# EAGLE design ink2 (EAGLE 8.0.2)
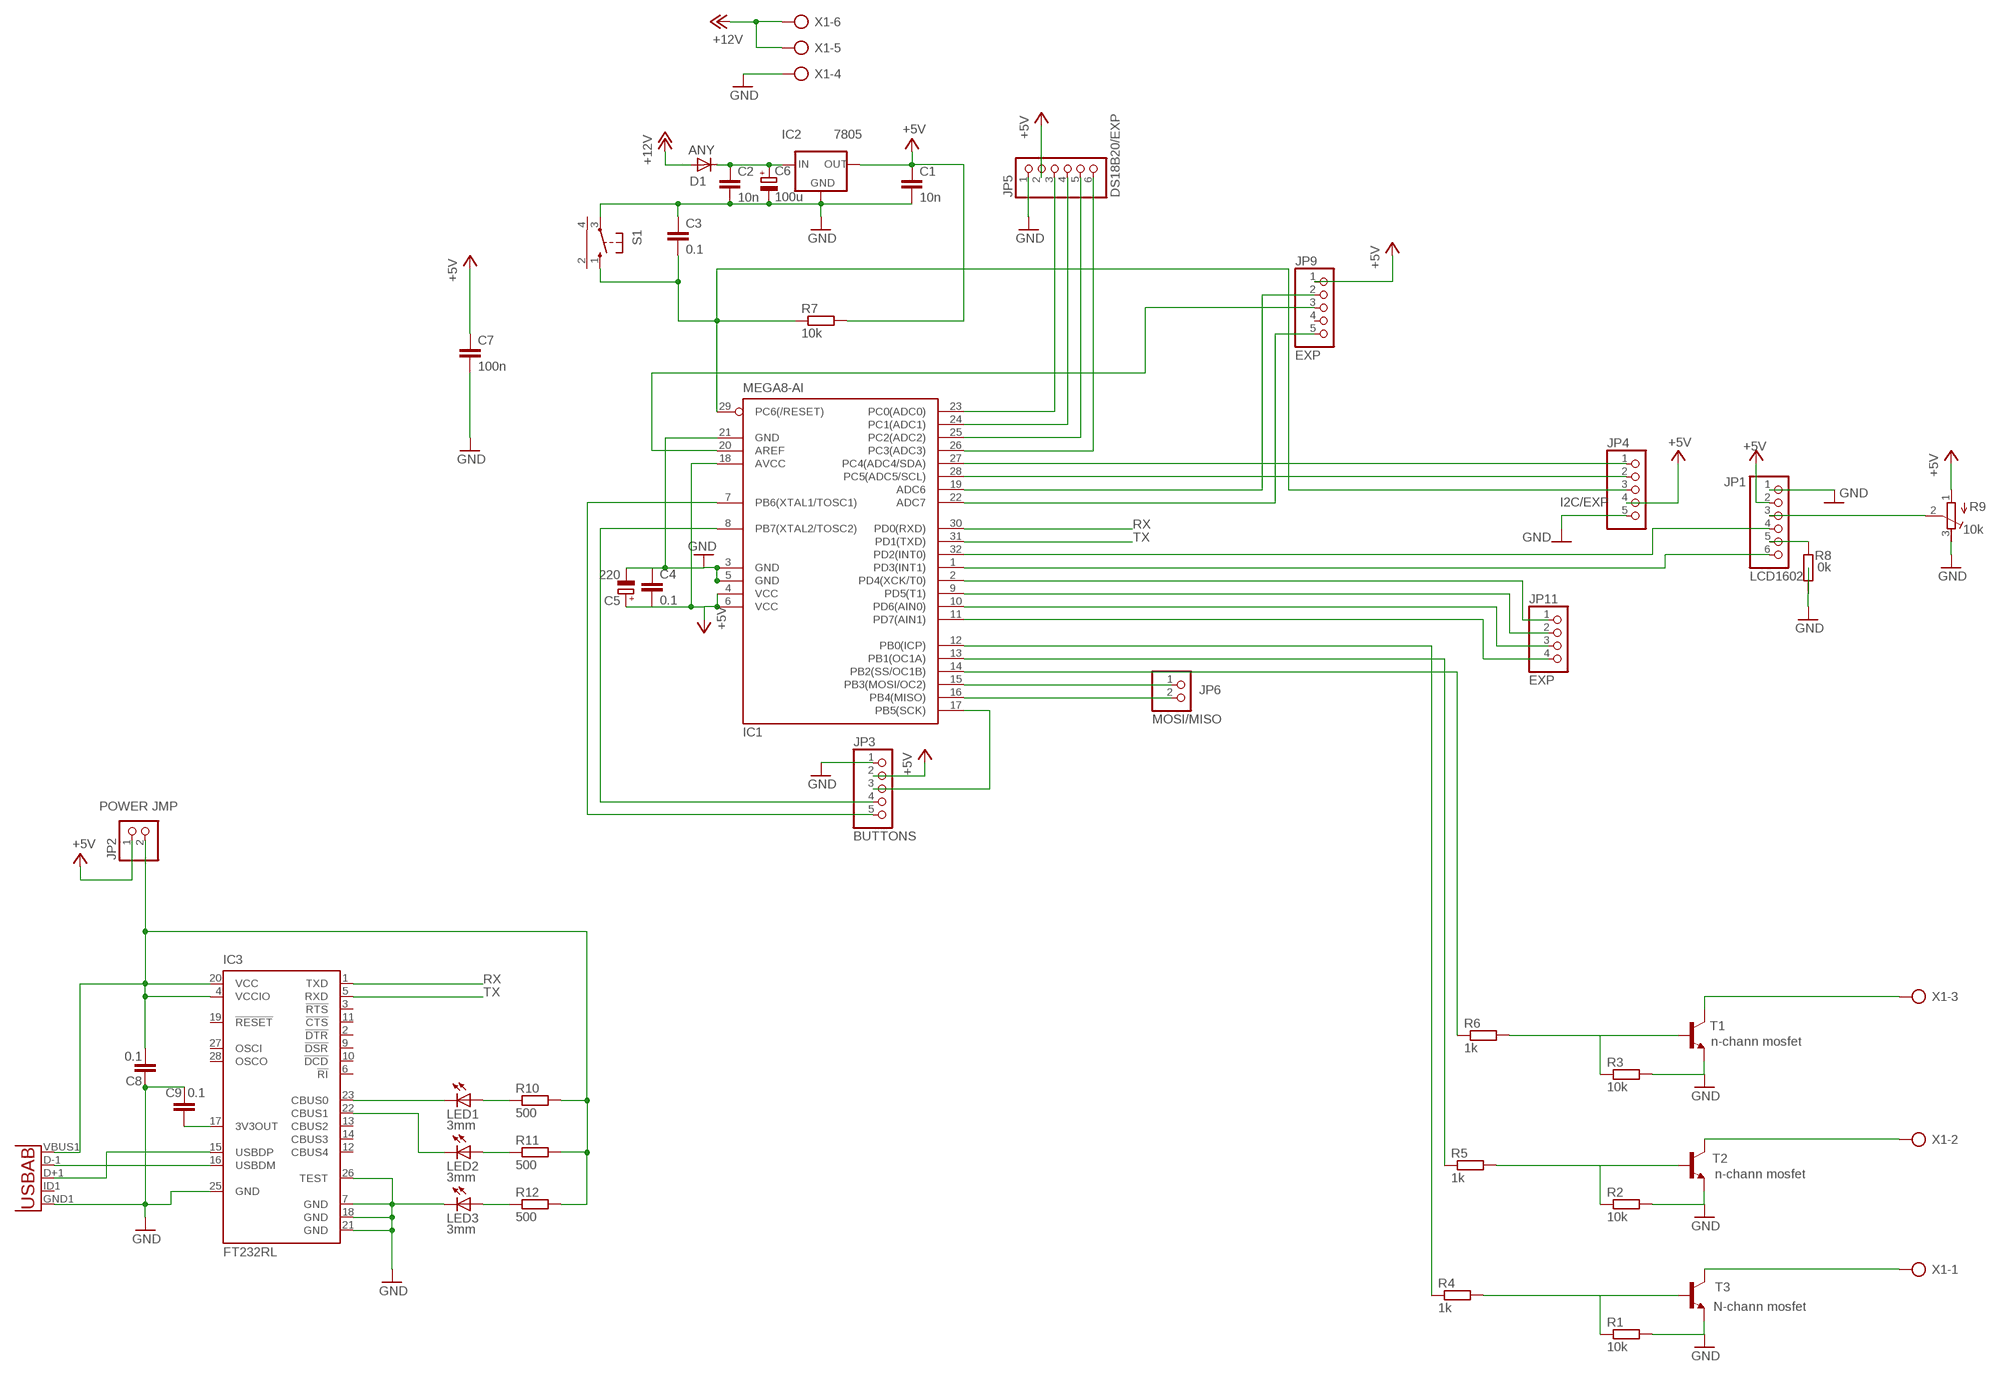
[diagram p0: schematic, sheet 1]

## Parts
ANY  D1  CGRM4001-G  [SOD-123_MINI-SMA]
C1  10n  C-EUC1206  [C1206]
C2  10n  C-EUC1206  [C1206]
C3  0.1  C-EUC1206  [C1206]
C4  0.1  C-EUC1206  [C1206]
C5  220  CPOL-EU175TMP-0808  [175TMP-0808]
C6  100u  CPOL-EU140CLH-1010  [140CLH-1010]
C7  100n  C-EUC1206K  [C1206K]
C8  0.1  C-EUC1206  [C1206]
C9  0.1  C-EUC1206  [C1206]
IC1  MEGA8-AI  [TQFP32-08]
IC2  7805  78MXXLDP  [DPACK]
IC3  FT232RL  [SSOP28]
JP1  LCD1602  PINHD-1X6  [1X06]
JP2  POWER JMP  PINHD-1X2  [1X02]
JP3  BUTTONS  PINHD-1X5  [1X05]
JP4  I2C/EXP  PINHD-1X5  [1X05]
JP5  DS18B20/EXP  PINHD-1X6  [1X06]
JP6  MOSI/MISO  PINHD-1X2  [1X02]
JP9  EXP  PINHD-1X5  [1X05]
JP11  EXP  PINHD-1X4  [1X04]
LED1  3mm  LED3MM  [LED3MM]
LED2  3mm  LED3MM  [LED3MM]
LED3  3mm  LED3MM  [LED3MM]
R1  10k  R-EU_M1206  [M1206]
R2  10k  R-EU_M1206  [M1206]
R3  10k  R-EU_M1206  [M1206]
R4  1k  R-EU_M1206  [M1206]
R5  1k  R-EU_M1206  [M1206]
R6  1k  R-EU_M1206  [M1206]
R7  10k  R-EU_M1206  [M1206]
R8  0k  R-EU_M1206  [M1206]
R9  10k  R-TRIMM64Y  [RTRIM64Y]
R10  500  R-EU_M1206  [M1206]
R11  500  R-EU_M1206  [M1206]
R12  500  R-EU_M1206  [M1206]
S1  10-XX-RPAD  [B3F-10XX-RPAD]
T1  n-chann mosfet  MJD31  [DPAK]
T2  n-chann mosfet  MJD31  [DPAK]
T3  N-chann mosfet  MJD31  [DPAK]
U1  USB""  [USB-MICRO-SMD]
X1  AK300/6  [AK300/6]

## Nets
+5V: C1.1 C4.2 C5.+ C7.1 IC1.4(VCC) IC1.6(VCC) IC1.18(AVCC) IC2.3(OUT) JP1.2 JP2.1 JP3.2 JP4.4 JP5.2 JP9.1 R7.2 R9.1(A)
+12V: ANY.A X1.5 X1.6
GND: C1.2 C2.2 C3.1 C4.1 C5.- C6.- C7.2 C8.2 C9.2 IC1.3(GND) IC1.5(GND) IC1.21(GND) IC2.4(GND) IC3.7(GND) IC3.18(GND) IC3.21(GND) IC3.25(GND) IC3.26(TEST) JP1.1 JP3.1 JP4.5 JP5.1 LED3.K(C) R1.2 R2.2 R3.2 R8.2 R9.3(E) S1.3(P) T1.3(E) T2.3(E) T3.3(E) U1.GND1(GND) X1.4
N$1: IC1.11(PD7(AIN1)) JP11.4
N$2: IC1.1(PD3(INT1)) JP1.6
N$3: IC1.2(PD4(XCK/T0)) JP11.1
N$4: ANY.C C2.1 C6.+ IC2.1(IN)
N$5: IC1.15(PB3(MOSI/OC2)) JP6.1
N$6: JP1.3 R9.2(S)
N$7: IC1.17(PB5(SCK)) JP3.3
N$8: IC1.16(PB4(MISO)) JP6.2
N$10: IC1.8(PB7(XTAL2/TOSC2)) JP3.4
N$11: IC1.7(PB6(XTAL1/TOSC1)) JP3.5
N$12: R1.1 R4.2 T3.1(B)
N$13: R2.1 R5.2 T2.1(B)
N$14: R3.1 R6.2 T1.1(B)
N$15: IC1.10(PD6(AIN0)) JP11.3
N$16: IC1.9(PD5(T1)) JP11.2
N$17: IC1.14(PB2(SS/OC1B)) R6.1
N$18: IC1.27(PC4(ADC4/SDA)) JP4.1
N$19: IC1.28(PC5(ADC5/SCL)) JP4.2
N$20: IC1.23(PC0(ADC0)) JP5.3
N$21: T1.4(C) X1.3
N$22: T2.4(C) X1.2
N$23: T3.4(C) X1.1
N$24: IC1.24(PC1(ADC1)) JP5.4
N$25: IC1.25(PC2(ADC2)) JP5.5
N$26: IC1.26(PC3(ADC3)) JP5.6
N$29: IC1.32(PD2(INT0)) JP1.4
N$30: IC3.23(CBUS0) LED1.K(C)
N$31: IC3.16(USBDM) U1.D-1(D-)
N$32: IC1.20(AREF) JP9.3
N$33: IC1.19(ADC6) JP9.2
N$34: IC1.22(ADC7) JP9.5
N$36: IC3.22(CBUS1) LED2.K(C)
N$38: LED2.A R11.1
N$39: IC1.13(PB1(OC1A)) R5.1
N$40: IC1.12(PB0(ICP)) R4.1
N$41: JP1.5 R8.1
N$42: IC3.15(USBDP) U1.D+1(D+)
N$43: LED1.A R10.1
N$44: C9.1 IC3.17(3V3OUT)
N$45: C8.1 IC3.4(VCCIO) IC3.20(VCC) JP2.2 R10.2 R11.2 R12.2 U1.VBUS1(VBUS)
N$46: LED3.A R12.1
RESET: C3.2 IC1.29(PC6(/RESET)) JP4.3 R7.1 S1.1(S)
RX: IC1.30(PD0(RXD)) IC3.1(TXD)
TX: IC1.31(PD1(TXD)) IC3.5(RXD)
Unconnected: IC3.2(!DTR) IC3.3(!RTS) IC3.6(!RI) IC3.9(!DSR) IC3.10(!DCD) IC3.11(!CTS) IC3.12(CBUS4) IC3.13(CBUS2) IC3.14(CBUS3) IC3.19(!RESET) IC3.27(OSCI) IC3.28(OSCO) JP9.4 S1.2(GND1) S1.4(GND2) U1.ID1(USBID)

## Library data of the parts
ANY = diode:CGRM400*-G: Molded plasitc,JEDEC SOD-123/Mini SMA Source: Comchip CGRM4001-G.pdf
C1-C4 C7-C9 = resistor:C-EU: CAPACITOR, European symbol
C5 C6 = resistor:CPOL-EU: POLARIZED CAPACITOR, European symbol
IC1 = atmel:MEGA8: MICROCONTROLLER 8 Kbytes FLASH, 1 kbytes SRAM, 512 bytes EEPROM, USART, 6-channel 10 bit ADC, 2-channel 8 bit ADC Pin compatible with Atmega48, ATMega88, ATMega168 Source: avr.lbr; MPN: ATMEGA8-16AU; OC_FARNELL: 9171371; OC_NEWARK: 73M8863
IC2 = v-reg:78MXXL: VOLTAGE REGULATOR
IC3 = ftdichip:FT232R: Source: http://www.ftdichip.com/Documents/DataSheets/DS_FT232R_v104.pdf; MPN: FT232RL; OC_FARNELL: 1146032; OC_NEWARK: 91K9918
JP1 JP5 = pinhead:PINHD-1X6: PIN HEADER
JP2 JP6 = pinhead:PINHD-1X2: PIN HEADER
JP3 JP4 JP9 = pinhead:PINHD-1X5: PIN HEADER
JP11 = pinhead:PINHD-1X4: PIN HEADER
LED1-LED3 = led:LED: LED OSRAM: - CHIPLED LG R971, LG N971, LY N971, LG Q971, LY Q971, LO R971, LY R971 LH N974, LH R974 LS Q976, LO Q976, LY Q976 LO Q996 - Hyper CHIPLED LW Q18S LB Q993, LB Q99A, LB R99A - SideLED LS A670, LO A670, LY A670, LG A670, LP A670 LB A673, LV A673, LT A673, LW A673 LH A674 LY A675 LS A676, LA A676, LO A676, LY A676, LW A676 LS A679, LY A679, LG A679 - Hyper Micro SIDELED® LS Y876, LA Y876, LO Y876, LY Y876 LT Y87S - SmartLED LW L88C, LW L88S LB L89C, LB L89S, LG L890 LS L89K, LO L89K, LY L89K LS L896, LA L896, LO L896, LY L896 - TOPLED LS T670, LO T670, LY T670, LG T670, LP T670 LSG T670, LSP T670, LSY T670, LOP T670, LYG T670 LG T671, LOG T671, LSG T671 LB T673, LV T673, LT T673, LW T673 LH T674 LS T676, LA T676, LO T676, LY T676, LB T676, LH T676, LSB T676, LW T676 LB T67C, LV T67C, LT T67C, LS T67K, LO T67K, LY T67K, LW E67C LS E67B, LA E67B, LO E67B, LY E67B, LB E67C, LV E67C, LT E67C LW T67C LS T679, LY T679, LG T679 LS T770, LO T770, LY T770, LG T770, LP T770 LB T773, LV T773, LT T773, LW T773 LH T774 LS E675, LA E675, LY E675, LS T675 LS T776, LA T776, LO T776, LY T776, LB T776 LHGB T686 LT T68C, LB T68C - Hyper Mini TOPLED® LB M676 - Mini TOPLED Santana® LG M470 LS M47K, LO M47K, LY M47K Source: http://www.osram.convergy.de LUXEON: - LUMILED® LXK2-PW12-R00, LXK2-PW12-S00, LXK2-PW14-U00, LXK2-PW14-V00 LXK2-PM12-R00, LXK2-PM12-S00, LXK2-PM14-U00 LXK2-PE12-Q00, LXK2-PE12-R00, LXK2-PE12-S00, LXK2-PE14-T00, LXK2-PE14-U00 LXK2-PB12-K00, LXK2-PB12-L00, LXK2-PB12-M00, LXK2-PB14-N00, LXK2-PB14-P00, LXK2-PB14-Q00 LXK2-PR12-L00, LXK2-PR12-M00, LXK2-PR14-Q00, LXK2-PR14-R00 LXK2-PD12-Q00, LXK2-PD12-R00, LXK2-PD12-S00 LXK2-PH12-R00, LXK2-PH12-S00 LXK2-PL12-P00, LXK2-PL12-Q00, LXK2-PL12-R00 Source: www.luxeon.com KINGBRIGHT: KA-3528ASYC Source: www.kingbright.com
R1-R7 R10-R12 = resistor:R-EU_: RESISTOR, European symbol
R8 = rcl:R-EU_: RESISTOR, European symbol
R9 = resistor:R-TRIMM: Trimm resistor
S1 = RepRapjr:10-XX-RPAD: OMRON SWITCH
T1-T3 = transistor-neu-to92:MJD31*: Complementary Power Transistors
U1 = microusb:USB: This is a USB AB connector that is compatible with USB OTG. i.e. this connector can serve as a host or device
X1 = con-ptr500:AK300/6: CONNECTOR; OC_FARNELL: unknown; OC_NEWARK: unknown

## Board
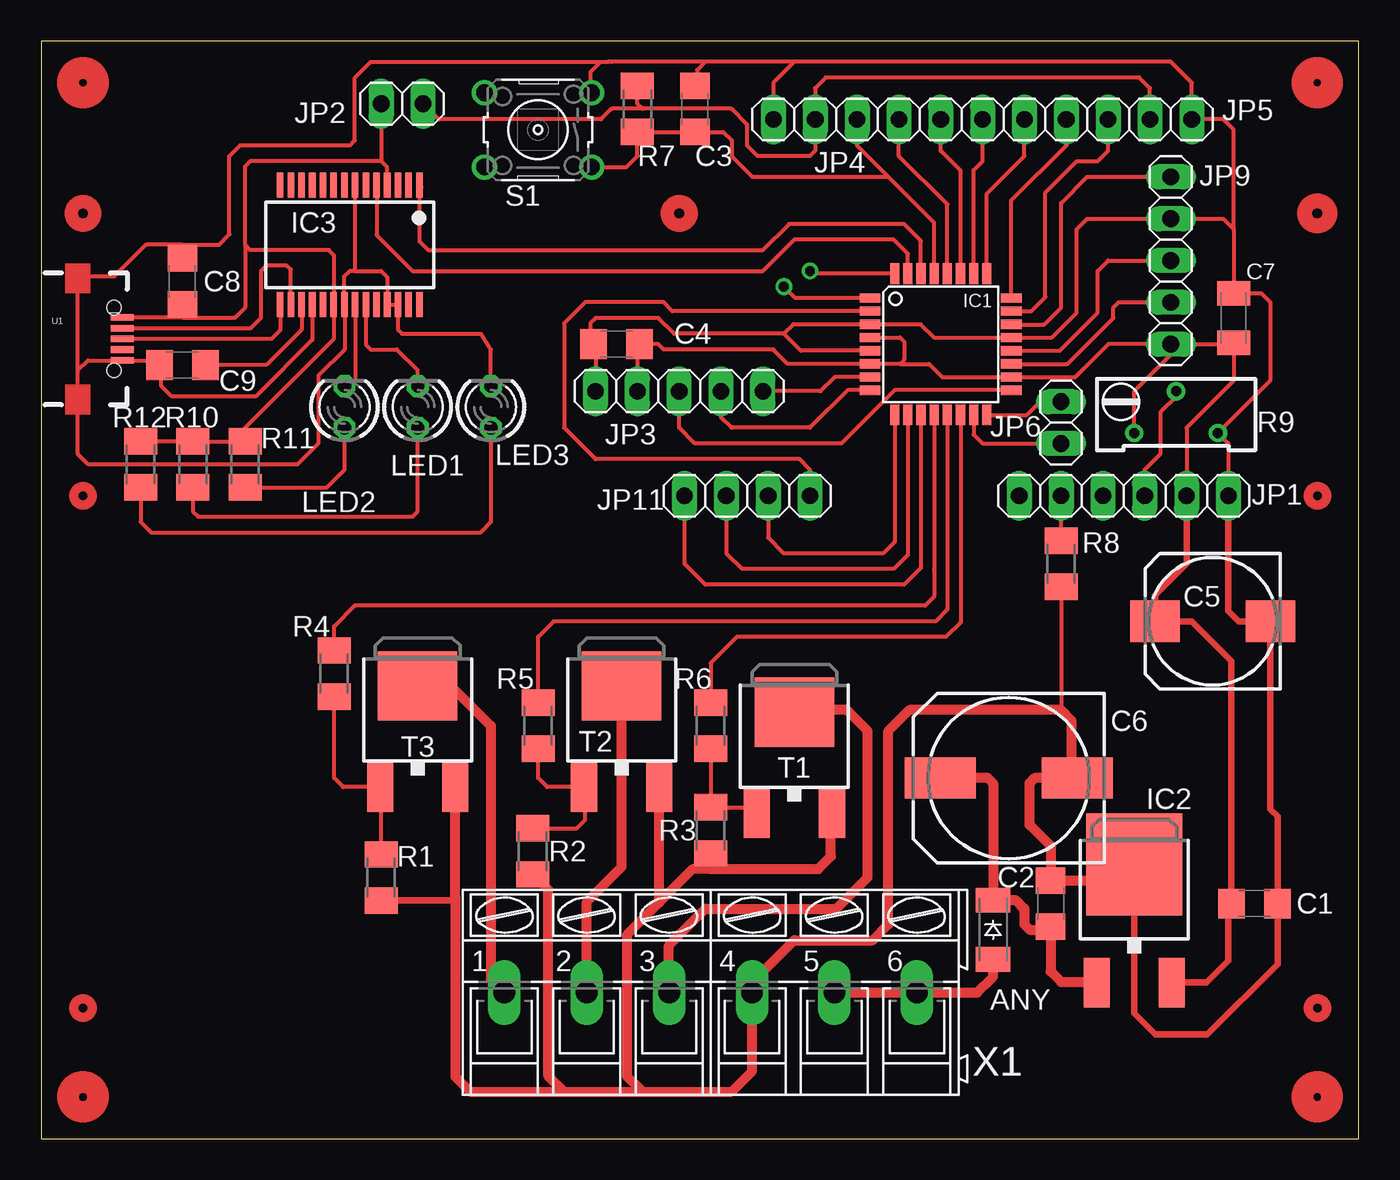
[diagram p1: board, top side]
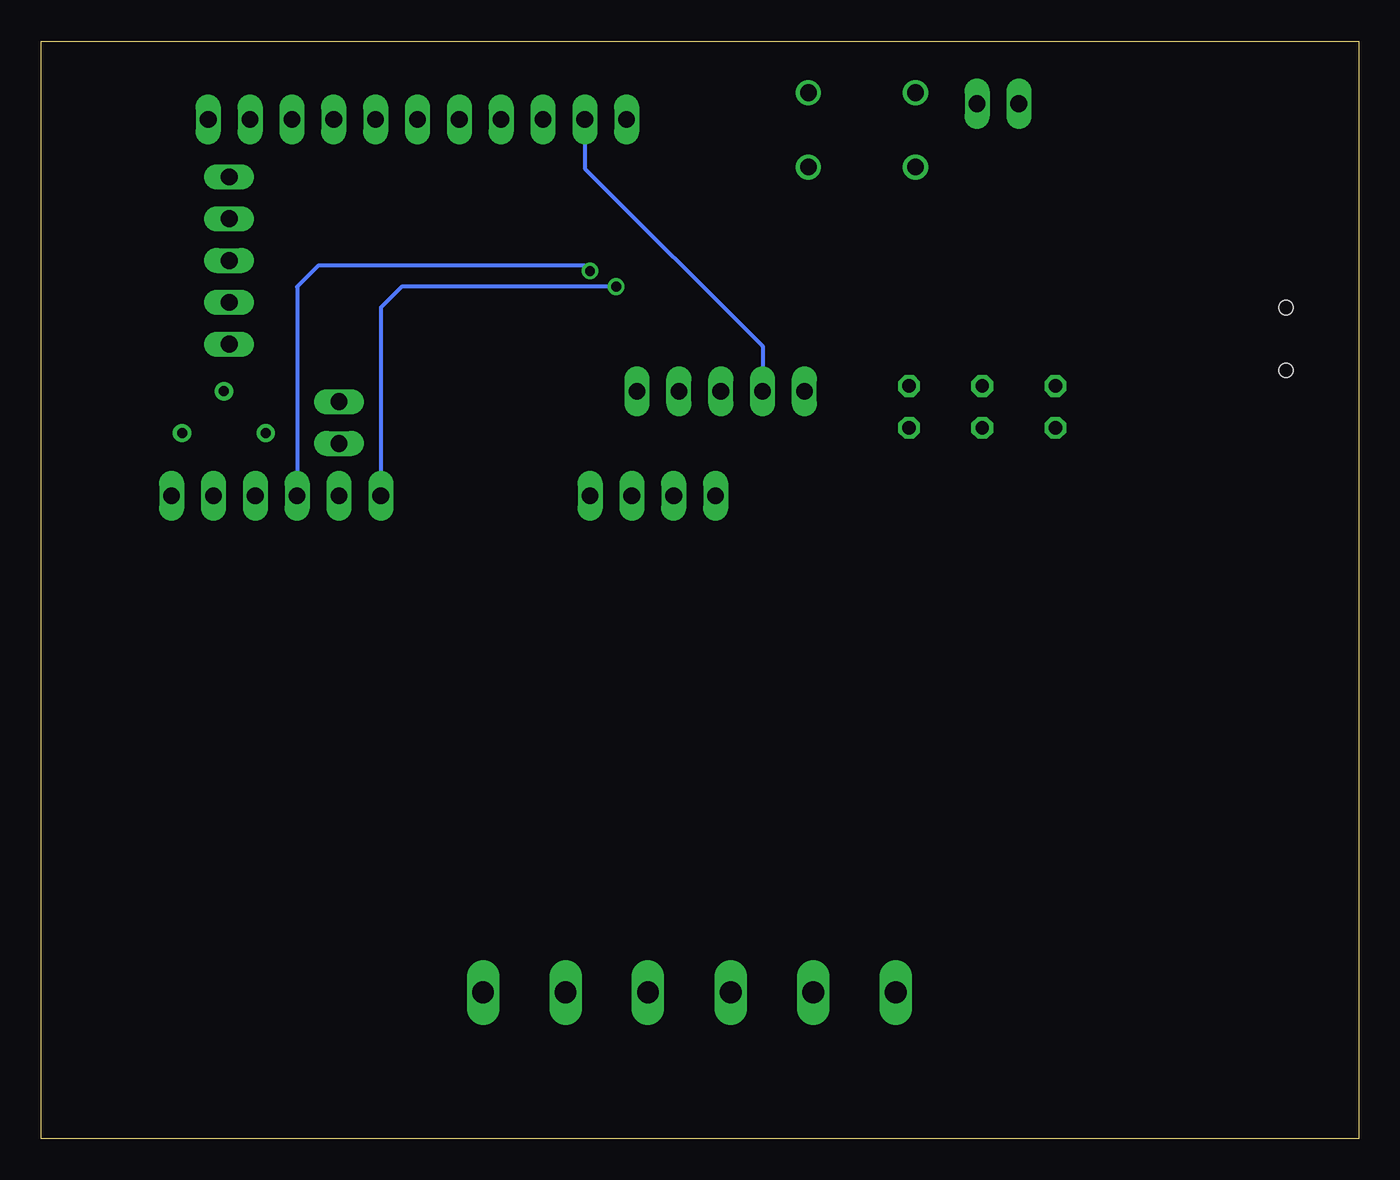
[diagram p2: board, bottom side, seen from below]

Size 79.99 x 66.66 mm. Coordinates in mm from the lower left corner, seen from the top.
Outline: 0,0 79.99,0 79.99,66.66 0,66.66 0,0
Copper layers (1*16): Top 0.035mm / dielectric 1.5mm / Bottom 0.035mm
Design rules "5class *": minimum track width 4mil, minimum drill 12mil, track to track 8mil, track to pad 8mil, pad to pad 8mil, via to via 8mil, smd to smd 8mil, copper to edge 40mil, drill to drill 8mil, minimum pad ring 10mil, minimum via ring 8mil, stop-mask expansion 4mil, vias tented up to drill 0mil, thermal gap 10mil

### Footprints (pad centres in the part's own frame; a part is rotated, then mirrored left to right if it is on the bottom)
SOD-123_MINI-SMA = smd 1.5 x 2.1: A 1.8,0; C -1.8,0
C1206 = smd 1.6 x 1.8: 1 -1.4,0; 2 1.4,0
175TMP-0808 = smd 3 x 2.5: + 3.5,0; - -3.5,0
140CLH-1010 = smd 4.3 x 2.5: + 4.15,0; - -4.15,0
C1206K = smd 1.5 x 2: 1 -1.5,0; 2 1.5,0
TQFP32-08 = smd 1.27 x 0.559: 1 -4.293,2.8; 2 -4.293,2; 3 -4.293,1.2; 4 -4.293,0.4; 5 -4.293,-0.4; 6 -4.293,-1.2; 7 -4.293,-2; 8 -4.293,-2.8; 17 4.293,-2.8; 18 4.293,-2; 19 4.293,-1.2; 20 4.293,-0.4; 21 4.293,0.4; 22 4.293,1.2; 23 4.293,2; 24 4.293,2.8 | smd 0.559 x 1.27: 9 -2.8,-4.293; 10 -2,-4.293; 11 -1.2,-4.293; 12 -0.4,-4.293; 13 0.4,-4.293; 14 1.2,-4.293; 15 2,-4.293; 16 2.8,-4.293; 25 2.8,4.293; 26 2,4.293; 27 1.2,4.293; 28 0.4,4.293; 29 -0.4,4.293; 30 -1.2,4.293; 31 -2,4.293; 32 -2.8,4.293
DPACK = smd 1.6 x 3: 1 -2.28,-4.8; 3 2.28,-4.8 | smd 5.8 x 6.2: 4 0,2.38
SSOP28 = smd 0.4 x 1.5: 1 -4.225,-3.625; 2 -3.575,-3.625; 3 -2.925,-3.625; 4 -2.275,-3.625; 5 -1.625,-3.625; 6 -0.975,-3.625; 7 -0.325,-3.625; 8 0.325,-3.625; 9 0.975,-3.625; 10 1.625,-3.625; 11 2.275,-3.625; 12 2.925,-3.625; 13 3.575,-3.625; 14 4.225,-3.625; 15 4.225,3.625; 16 3.575,3.625; 17 2.925,3.625; 18 2.275,3.625; 19 1.625,3.625; 20 0.975,3.625; 21 0.325,3.625; 22 -0.325,3.625; 23 -0.975,3.625; 24 -1.625,3.625; 25 -2.275,3.625; 26 -2.925,3.625; 27 -3.575,3.625; 28 -4.225,3.625
1X06 = drill 1.016 long: 1 -6.35,0; 2 -3.81,0; 3 -1.27,0; 4 1.27,0; 5 3.81,0; 6 6.35,0
1X02 = drill 1.016 long: 1 -1.27,0; 2 1.27,0
1X05 = drill 1.016 long: 1 -5.08,0; 2 -2.54,0; 3 0,0; 4 2.54,0; 5 5.08,0
1X04 = drill 1.016 long: 1 -3.81,0; 2 -1.27,0; 3 1.27,0; 4 3.81,0
LED3MM = drill 0.813 octagon: A -1.27,0; K 1.27,0
M1206 = smd 1.6 x 2: 1 -1.4,0; 2 1.4,0
RTRIM64Y = drill 0.61: 1 0,-2.54; 2 -2.54,0; 3 0,2.54
B3F-10XX-RPAD = drill 1.016: 1 -3.251,2.261; 2 3.251,2.261; 3 -3.251,-2.261; 4 3.251,-2.261
DPAK = smd 1.6 x 3: 1 -2.28,-4.04; 3 2.28,-4.04 | smd 4.826 x 4.191: 4 0,2.096
USB-MICRO-SMD = smd 1.4 x 0.4: D+1 2.7,0; D-1 2.7,0.65; GND1 2.7,-1.3; ID1 2.7,-0.65; VBUS1 2.7,1.3 | hole 0.85: 2.2,1.9; 2.2,-1.9
AK300/6 = drill 1.321 long: 1 -12.522,0; 2 -7.518,0; 3 -2.515,0; 4 2.515,0; 5 7.518,0; 6 12.522,0

### Placement (x,y rotation side)
ANY  57.78,12.7 270 top
C1  73.66,14.29 0 top
C2  61.28,14.29 90 top
C3  39.69,62.55 270 top
C4  34.92,48.26 0 top
C5  71.12,31.43 180 top
C6  58.74,21.91 180 top
C7  72.39,49.85 90 top
C8  8.57,52.07 90 top
C9  8.57,46.99 180 top
IC1  54.61,48.26 0 top
IC2  66.36,14.29 0 top
IC3  18.73,54.29 180 top
JP1  65.72,39.05 180 top
JP2  21.91,62.87 180 top
JP3  38.73,45.4 0 top
JP4  49.53,61.91 180 top
JP5  63.5,61.91 180 top
JP6  61.91,43.5 90 top
JP9  68.58,53.34 90 top
JP11  42.86,39.05 180 top
LED1  22.86,44.45 90 top
LED2  18.41,44.45 90 top
LED3  27.3,44.45 90 top
R1  20.64,15.88 270 top
R2  29.84,17.46 270 top
R3  40.64,18.73 270 top
R4  17.78,28.26 270 top
R5  30.16,25.08 270 top
R6  40.64,25.08 270 top
R7  36.19,62.55 90 top
R8  61.91,34.93 270 top
R9  68.9,42.86 270 top
R10  9.21,40.96 90 top
R11  12.38,40.96 90 top
R12  6.03,40.96 90 top
S1  30.16,61.28 180 top
T1  45.72,23.81 0 top
T2  35.24,25.4 0 top
T3  22.86,25.4 0 top
U1  2.22,48.58 0 top
X1  40.64,8.89 0 top

### Tracks (layer width: path | path; a pad name or v marks a point on that pad's centre or on a via)
+5V  (via drill 0.6)
  Top 0.254: 52.14,47.06 IC1.6 45.33,47.06 44.45,47.94 37.78,47.94 37.47,48.26 C4.2 36.19,48.13 JP3.2 | 52.14,47.06 52.39,47.31 52.39,48.42 52.15,48.66 IC1.4 | JP1.2 69.53,43.18 72.39,46.04 C7.1 72.3,48.26 JP9.1 | JP9.1 64.77,48.26 62.77,46.26 IC1.18 54.7,46.26 53.91,47.06 52.14,47.06 | JP9.1 68.58,47.62 66.36,45.4 R9.1 | JP5.2 67.31,63.82 66.67,64.45 47.62,64.45 46.99,63.82 JP4.4 46.99,60.01 46.67,59.69 43.5,59.69 42.86,60.33 42.86,61.6 41.91,62.55 36.51,62.55 | 36.51,62.55 36.19,62.87 R7.2 | JP2.1 24.13,61.91 33.97,61.91 34.61,62.55 36.51,62.55
  Top 0.305: 58.81,46.36 IC1.18 59,46.36
  Top 0.406: IC2.3 70.77,9.49 72.07,10.79 72.07,14.1 C1.1 | 72.07,14.47 C1.1 | JP1.2 69.53,34.93 67.63,33.02 C5.+ 69.85,31.43 72.26,29.02 C1.1
  Bottom 0.254: JP4.4 46.99,58.93 36.19,48.13 JP3.2
  other vias: 46.99,61.91
+12V
  Top 0.61: X1.5 X1.6 56.83,8.89 57.78,9.84 ANY.A
GND
  Top 0.254: 43.18,8.91 X1.4 | 25.01,14.47 25.14,14.61 | 72.39,55.25 71.75,55.88 63.5,55.88 62.86,55.25 62.86,50.17 61.36,48.66 IC1.21 54.21,48.66 53.41,49.46 IC1.3 45.65,49.46 45.08,48.9 | JP1.1 72.07,42.23 R9.3 74.61,46.04 74.61,50.8 74.06,51.35 C7.2 72.39,55.25 | R8.2 61.91,26.04 | 72.39,55.25 72.39,61.28 71.75,61.91 JP5.1 69.85,64.14 68.58,65.41 45.72,65.41 | 45.72,65.41 44.45,64.14 JP4.5 | 45.72,65.41 40.32,65.41 | 40.32,65.41 39.82,64.9 39.82,63.82 C3.1 | JP3.1 33.66,48.13 C4.1 33.34,48.45 33.34,49.53 33.66,49.85 37.47,49.85 38.42,48.9 45.08,48.9 | IC1.5 46.12,47.86 45.08,48.9 | 40.32,65.41 34.61,65.41 34.4,65.41 33.97,65.41 | 2.22,46.67 2.83,47.28 U1.GND1 6.88,47.28 C9.2 7.3,46.86 7.3,45.72 7.94,45.09 13.02,45.09 16.46,48.53 IC3.18 | 2.22,46.67 2.22,52.39 4.44,52.39 6.35,54.29 8.57,54.29 | 19.05,52.71 18.73,52.71 18.41,52.38 IC3.21 18.41,47.94 16.83,46.36 16.83,42.23 15.56,40.96 2.86,40.96 2.22,41.59 2.22,46.67 | 19.05,52.71 20.64,52.71 21.01,52.34 IC3.25 IC3.26 21.66,49.15 21.91,48.9 26.67,48.9 27.3,47.94 LED3.K | IC3.7 19.05,52.71 | 8.57,54.29 10.79,54.29 11.43,54.93 11.43,59.69 12.06,60.33 18.73,60.33 19.05,60.64 19.05,64.45 20,65.41 33.97,65.41 | C8.2 8.57,54.29 | 33.97,65.41 33.34,64.77 33.34,63.61 S1.3
  Top 0.305: 50.39,49.53 IC1.3 | 25.08,20.32 25.08,21.3 T3.3 | 36.51,2.86 41.91,2.86 | 36.35,3.02 36.51,2.86 | 31.75,2.86 36.51,2.86
  Top 0.406: R1.2 25.01,14.47 | IC2.4 66.36,7.62 67.63,6.35 70.8,6.35 75.06,10.61 C1.2 75.06,19.57 74.62,20.01 | JP1.1 72.07,32.07 72.71,31.43 C5.- 74.62,20.01 | 74.62,20.01 74.61,20
  Top 0.61: 31.75,2.86 41.91,2.86 43.16,4.1 X1.4 43.16,9.5 45.72,12.06 50.48,12.06 51.43,13.02 51.43,24.77 52.7,26.04 61.91,26.04 62.55,25.4 62.55,21.91 | 31.75,2.86 30.8,3.81 30.8,15.11 R2.2 | 36.35,3.02 35.56,3.81 35.56,12.38 37.52,14.34 | T3.3 25.14,14.61 25.14,3.75 26.04,2.86 31.75,2.86 | 62.55,21.91 C6.- | 62.55,21.91 60.32,21.91 60.01,21.59 60.01,19.05 61.28,17.78 C2.2 65.38,15.69 IC2.4 | T1.3 47.94,19.71 47.94,17.14 47.18,16.38 40.64,16.38 | 37.52,14.34 T2.3 | 40.64,16.38 39.56,16.38 37.52,14.34 | R3.2 40.64,16.38
N$1
  Top 0.254: JP11.4 39.05,34.93 40.32,33.66 52.39,33.66 53.41,34.68 IC1.11
N$2  (via drill 0.6)
  Top 0.254: IC1.1 45.78,51.06 v45.08,51.75
  Bottom 0.254: v45.08,51.75 58.1,51.75 59.37,50.48 JP1.6
N$3
  Top 0.254: JP11.1 46.67,40.64 46.04,41.28 33.66,41.28 31.75,43.18 31.75,49.53 33.02,50.8 37.78,50.8 38.32,50.26 IC1.2
N$4
  Top 0.61: IC2.1 64.04,9.53 61.91,9.53 61.28,10.16 C2.1 61.09,12.7 60.01,12.7 59.69,13.02 59.69,13.97 59.16,14.5 ANY.C 57.78,21.59 57.47,21.91 C6.+
N$5
  Top 0.254: IC1.15 56.61,42.77 57.15,42.23 JP6.1
  Top 0.305: 56.52,43.87 IC1.15
N$6
  Top 0.254: R9.2 68.9,45.09 67.94,44.13 67.94,41.59 66.99,40.64 JP1.3
N$7
  Top 0.254: IC1.17 51.81,45.46 48.58,42.23 39.69,42.23 38.73,43.18 JP3.3
N$8
  Top 0.254: IC1.16 59.84,43.97 60.64,44.77 JP6.2
N$10
  Top 0.254: IC1.8 48.95,45.46 46.67,43.18 41.91,43.18 41.27,43.82 JP3.4
N$11
  Top 0.254: IC1.7 48.16,46.26 47.31,45.4 JP3.5
N$12
  Top 0.254: R1.1 20.64,21.3 T3.1 18.33,21.36 17.78,21.91 R4.2
N$13
  Top 0.254: R2.1 32.52,18.86 33.02,19.37 33.02,21.3 T2.1 30.71,21.36 30.16,21.91 R5.2
N$14
  Top 0.254: 42.85,19.18 T1.1 43.08,20.13 R3.1 R6.2
N$15
  Top 0.254: JP11.3 41.59,35.56 42.55,34.61 51.75,34.61 52.61,35.47 IC1.10
N$16
  Top 0.254: JP11.2 44.13,36.51 45.08,35.56 51.12,35.56 51.81,36.25 IC1.9
N$17
  Top 0.254: IC1.14 55.81,31.36 54.93,30.48 42.23,30.48 40.64,28.89 R6.1
N$18
  Top 0.254: IC1.27 55.81,58.81 54.61,60.01 JP4.1
N$19
  Top 0.254: IC1.28 55.01,56.75 52.07,59.69 JP4.2
N$20
  Top 0.254: IC1.23 60.1,50.26 60.96,51.12 60.96,57.47 62.86,59.37 64.13,59.37 64.77,60.01 JP5.3
N$21
  Top 0.61: X1.3 38.1,8.91 38.1,11.75 40.32,13.97 48.26,13.97 50.16,15.88 50.16,24.77 48.89,26.04 45.85,26.04 T1.4 45.91,27.3
N$22
  Top 0.61: T2.4 35.24,16.51 33.12,14.39 X1.2
N$23
  Top 0.61: T3.4 23.3,27.94 24.45,27.94 27.3,25.08 27.3,9.7 X1.1
N$24
  Top 0.254: JP5.4 62.23,60.33 58.9,57 IC1.24
N$25
  Top 0.254: IC1.25 57.41,57.41 59.69,59.69 JP5.5
N$26
  Top 0.254: IC1.26 56.61,58.83 57.15,59.37 JP5.6
N$29  (via drill 0.6)
  Top 0.254: IC1.32 46.83,52.55 v46.67,52.71
  Bottom 0.254: v46.67,52.71 46.99,53.02 63.18,53.02 64.45,51.75 JP1.4
N$30
  Top 0.254: LED1.K 22.86,46.67 21.59,47.94 20,47.94 19.71,48.24 IC3.23
N$31
  Top 0.254: IC3.16 15.16,52.79 14.92,53.02 13.65,53.02 13.33,52.71 13.33,49.85 12.7,49.21 4.94,49.21 U1.D-1
N$32
  Top 0.254: IC1.20 61.83,47.86 64.13,50.17 64.13,52.71 64.77,53.34 JP9.3
N$33
  Top 0.254: IC1.19 62.3,47.06 65.09,49.85 65.09,50.48 65.41,50.8 JP9.2
N$34
  Top 0.254: IC1.22 60.89,49.46 61.91,50.48 61.91,56.83 63.5,58.42 JP9.5
N$36
  Top 0.254: IC3.22 19.06,46.05 18.73,45.72 LED2.K
N$38
  Top 0.254: R11.1 17.33,39.56 18.41,40.64 LED2.A
N$39
  Top 0.254: R5.1 30.16,30.48 31.11,31.43 54.29,31.43 55.01,32.15 IC1.13
  Top 0.305: 54.93,43.89 IC1.13
N$40
  Top 0.254: R4.1 17.78,31.11 19.05,32.38 53.66,32.38 54.21,32.94 54.21,34.61 | IC1.12 54.21,34.61 | 54.21,34.61 54.21,34.53
N$41
  Top 0.254: R8.1 JP1.5
N$42
  Top 0.254: IC3.15 14.51,49.12 13.97,48.58 U1.D+1
N$43
  Top 0.254: R10.1 9.21,38.1 9.52,37.78 22.54,37.78 22.86,38.1 LED1.A
N$44
  Top 0.254: C9.1 13.65,46.99 15.81,49.15 IC3.17
N$45
  Top 0.254: 12.38,54.29 12.38,59.05 12.7,59.37 20.64,59.37 | 12.38,54.29 12.38,50.48 11.78,49.88 8.57,49.88 | 8.57,49.88 U1.VBUS1 | IC3.4 21.01,59 20.64,59.37 | 12.38,54.29 12.7,53.98 17.46,53.98 17.76,53.68 IC3.20 17.76,48.55 12.38,43.18 R11.2 R10.2 R12.2 | JP2.2 20.64,59.37 | C8.1 8.57,49.88
N$46
  Top 0.254: R12.1 6.03,37.47 6.67,36.83 26.67,36.83 27.3,37.47 LED3.A
RESET
  Top 0.254: IC1.29 54.21,55.65 51.43,58.42 | 51.43,58.42 49.53,60.33 JP4.3 | 51.43,58.42 43.18,58.42 41.91,59.69 41.91,60.64 41.41,61.15 C3.2 R7.1 36.19,59.69 35.52,59.02 S1.1
RX
  Top 0.254: IC1.30 53.41,54.54 52.39,55.56 45.4,55.56 43.81,53.98 23.5,53.98 22.96,54.51 IC3.1 23.09,57.79
TX
  Top 0.254: IC1.31 52.61,53.75 51.75,54.61 45.72,54.61 43.81,52.71 22.54,52.71 20.36,54.89 IC3.5
(copper drawn outside any net)
  shapes: Top circle x22